# Altium schematic sheet E17-06-PDU_E17-PDU-POWER.SchDoc
size A2
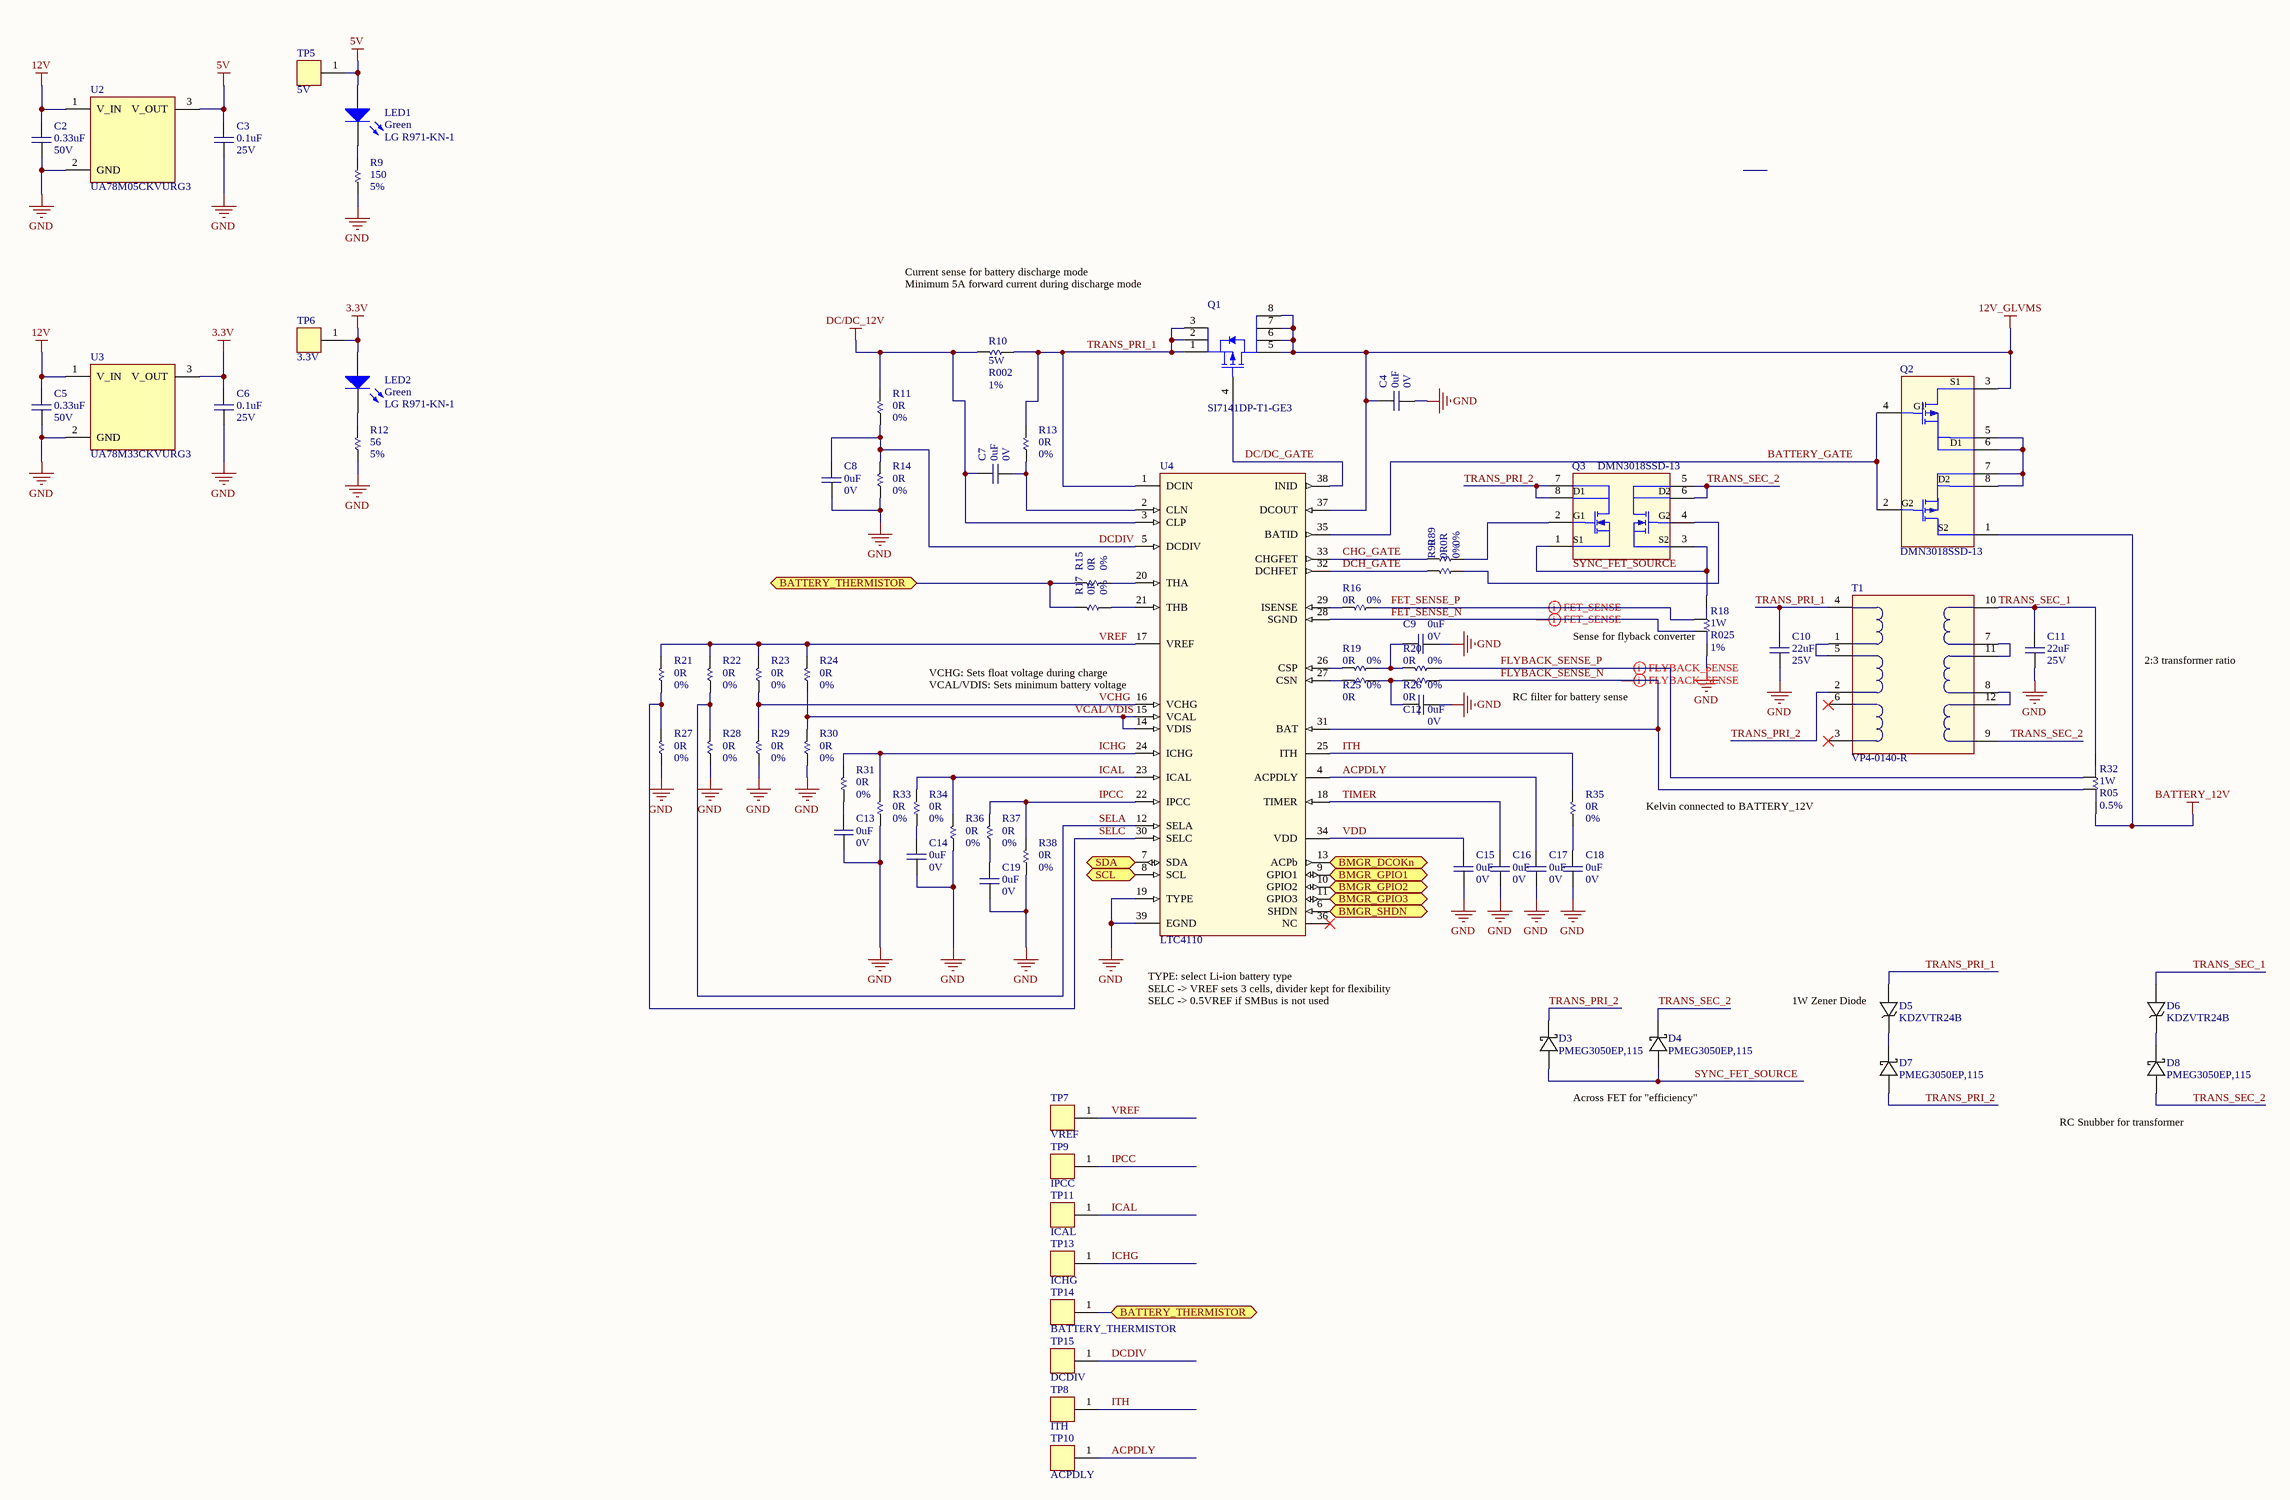
[diagram p0: E17-06-PDU_E17-PDU-POWER.SchDoc]

## Parts
C2  value 0.33uF  Voltage: 50V  [C0805]  (hidden comment: C_0805_Generic)
C3  value 0.1uF  Voltage: 25V  [C0805]  (hidden comment: C_0805_Generic)
C4  value 0uF  Voltage: 0V  [C0603]  (hidden comment: C_0603_Generic_1)
C5  value 0.33uF  Voltage: 50V  [C0805]  (hidden comment: C_0805_Generic)
C6  value 0.1uF  Voltage: 25V  [C0805]  (hidden comment: C_0805_Generic)
C7  value 0uF  Voltage: 0V  [C0603]  (hidden comment: C_0603_Generic_1)
C8  value 0uF  Voltage: 0V  [C0603]  (hidden comment: C_0603_Generic_1)
C9  value 0uF  Voltage: 0V  [C0402]  (hidden comment: C_0403_Generic)
C10  value 22uF  Voltage: 25V  [C0805]  (hidden comment: C_0805_Generic)
C11  value 22uF  Voltage: 25V  [C0805]  (hidden comment: C_0805_Generic)
C12  value 0uF  Voltage: 0V  [C0402]  (hidden comment: C_0403_Generic)
C13  value 0uF  Voltage: 0V  [C0402]  (hidden comment: C_0403_Generic)
C14  value 0uF  Voltage: 0V  [C0402]  (hidden comment: C_0403_Generic)
C15  value 0uF  Voltage: 0V  [C0603]  (hidden comment: C_0603_Generic_1)
C16  value 0uF  Voltage: 0V  [C0402]  (hidden comment: C_0403_Generic)
C17  value 0uF  Voltage: 0V  [C0402]  (hidden comment: C_0403_Generic)
C18  value 0uF  Voltage: 0V  [C0402]  (hidden comment: C_0403_Generic)
C19  value 0uF  Voltage: 0V  [C0402]  (hidden comment: C_0403_Generic)
D3  MFG_PN: PMEG3050EP,115  [SOD-128]  (hidden comment: D_PMEG3050EP,115)
D4  MFG_PN: PMEG3050EP,115  [SOD-128]  (hidden comment: D_PMEG3050EP,115)
D5  MFG_PN: KDZVTR24B  [SOD-123FL]  (hidden comment: D_ZENER)
D6  MFG_PN: KDZVTR24B  [SOD-123FL]  (hidden comment: D_ZENER)
D7  MFG_PN: PMEG3050EP,115  [SOD-128]  (hidden comment: D_PMEG3050EP,115)
D8  MFG_PN: PMEG3050EP,115  [SOD-128]  (hidden comment: D_PMEG3050EP,115)
LED1  Green  MFG_PN: LG R971-KN-1  [LGR971]
LED2  Green  MFG_PN: LG R971-KN-1  [LGR971]
Q1  MFG_PN: SI7141DP-T1-GE3  [PowerPak SO-8]  (hidden comment: Q_SI7141DP-T1-GE3)
Q2  MFG_PN: DMN3018SSD-13  [8-SOIC]  (hidden comment: Q_DMN3018SSD-13_1)
Q3  MFG_PN: DMN3018SSD-13  [8-SOIC]  (hidden comment: Q_DMN3018SSD-13)
R9  value 150  Tolerance: 5%  [R0805]  (hidden comment: R_0805_Generic)
R10  value R002  Power: 5W  Tolerance: 1%  [R2526]  (hidden comment: R_ERJ-MS6SF2M0U)
R11  value 0R  Tolerance: 0%  [R0603]  (hidden comment: R_0603_Generic)
R12  value 56  Tolerance: 5%  [R0805]  (hidden comment: R_0805_Generic)
R13  value 0R  Tolerance: 0%  [R0603]  (hidden comment: R_0603_Generic)
R14  value 0R  Tolerance: 0%  [R0603]  (hidden comment: R_0603_Generic)
R15  value 0R  Tolerance: 0%  [R0603]  (hidden comment: R_0603_Generic)
R16  value 0R  Tolerance: 0%  [R0402]  (hidden comment: R_0402_Generic)
R17  value 0R  Tolerance: 0%  [R0603]  (hidden comment: R_0603_Generic)
R18  value R025  Power: 1W  Tolerance: 1%  [R2512]  (hidden comment: R_LVK24R025FER)
R19  value 0R  Tolerance: 0%  [R0402]  (hidden comment: R_0402_Generic)
R20  value 0R  Tolerance: 0%  [R0402]  (hidden comment: R_0402_Generic)
R21  value 0R  Tolerance: 0%  [R0402]  (hidden comment: R_0402_Generic)
R22  value 0R  Tolerance: 0%  [R0402]  (hidden comment: R_0402_Generic)
R23  value 0R  Tolerance: 0%  [R0402]  (hidden comment: R_0402_Generic)
R24  value 0R  Tolerance: 0%  [R0402]  (hidden comment: R_0402_Generic)
R25  value 0R  Tolerance: 0%  [R0402]  (hidden comment: R_0402_Generic)
R26  value 0R  Tolerance: 0%  [R0402]  (hidden comment: R_0402_Generic)
R27  value 0R  Tolerance: 0%  [R0402]  (hidden comment: R_0402_Generic)
R28  value 0R  Tolerance: 0%  [R0402]  (hidden comment: R_0402_Generic)
R29  value 0R  Tolerance: 0%  [R0402]  (hidden comment: R_0402_Generic)
R30  value 0R  Tolerance: 0%  [R0402]  (hidden comment: R_0402_Generic)
R31  value 0R  Tolerance: 0%  [R0402]  (hidden comment: R_0402_Generic)
R32  value R05  Power: 1W  Tolerance: 0.5%  [R2512]  (hidden comment: R_LVK24R050DER)
R33  value 0R  Tolerance: 0%  [R0402]  (hidden comment: R_0402_Generic)
R34  value 0R  Tolerance: 0%  [R0402]  (hidden comment: R_0402_Generic)
R35  value 0R  Tolerance: 0%  [R0402]  (hidden comment: R_0402_Generic)
R36  value 0R  Tolerance: 0%  [R0402]  (hidden comment: R_0402_Generic)
R37  value 0R  Tolerance: 0%  [R0402]  (hidden comment: R_0402_Generic)
R38  value 0R  Tolerance: 0%  [R0402]  (hidden comment: R_0402_Generic)
R89  value 0R  Tolerance: 0%  [R0603]  (hidden comment: R_0603_Generic)
R90  value 0R  Tolerance: 0%  [R0603]  (hidden comment: R_0603_Generic)
T1  MFG_PN: VP4-0140-R  [T_VP4-0140-R]  (hidden comment: T_VP4-0140-R)
TP5  5V  [TEST POINT]
TP6  3.3V  [TEST POINT]
TP7  VREF  [TEST POINT]
TP8  ITH  [TEST POINT]
TP9  IPCC  [TEST POINT]
TP10  ACPDLY  [TEST POINT]
TP11  ICAL  [TEST POINT]
TP13  ICHG  [TEST POINT]
TP14  BATTERY_THERMISTOR  [TEST POINT]
TP15  DCDIV  [TEST POINT]
U2  MFG_PN: UA78M05CKVURG3  [TO-252-3]  (hidden comment: U_UA78M05CKVURG3)
U3  MFG_PN: UA78M33CKVURG3  [TO-252-3]  (hidden comment: U_UA78M33CKVURG3)
U4  MFG_PN: LTC4110  [U_LTC4110]  (hidden comment: U_LTC4110)

## Ports
BATTERY_THERMISTOR, BMGR_DCOKn, BMGR_GPIO1, BMGR_GPIO2, BMGR_GPIO3, BMGR_SHDN, SCL, SDA

## Nets
3.3V: C6.1(EGND) LED2.1(A) TP6.1 U3.3(V_OUT)
5V: C3.1(EGND) LED1.1(A) TP5.1 U2.3(V_OUT)
12V: C2.1(EGND) C5.1(EGND) U2.1(V_IN) U3.1(V_IN)
12V_GLVMS: C4.1(EGND) Q1.5 Q1.6 Q1.7 Q1.8 Q2.3 U4.37(DCOUT)
BATTERY_12V: Q2.1 R32.1
DC/DC_12V: C7.1(EGND) R10.1 R11.1 U4.3(CLP)
GND: C2.2 C3.2 C4.2 C5.2 C6.2 C8.2 C9.2 C10.2 C11.2 C12.1(EGND) C13.2 C14.2 C15.2 C16.2 C17.2 C18.2 C19.2 R9.2 R12.2 R14.2 R18.1 R27.2 R28.2 R29.2 R30.2 R33.2 R36.2 R38.2 U2.2(GND) U3.2(GND) U4.19(TYPE) U4.39(EGND)
ACPDLY: C17.1(EGND) TP10.1 U4.4(ACPDLY)
BATTERY_GATE: Q2.2 Q2.4 U4.35(BATID)
BATTERY_THERMISTOR: R15.1 R17.1 TP14.1 ; port BATTERY_THERMISTOR
BMGR_DCOKn: U4.13(ACPb) ; port BMGR_DCOKn
BMGR_GPIO1: U4.9(GPIO1) ; port BMGR_GPIO1
BMGR_GPIO2: U4.10(GPIO2) ; port BMGR_GPIO2
BMGR_GPIO3: U4.11(GPIO3) ; port BMGR_GPIO3
BMGR_SHDN: U4.6(SHDN) ; port BMGR_SHDN
CHG_GATE: R89.1 U4.33(CHGFET)
DC/DC_GATE: Q1.4(G) U4.38(INID)
DCDIV: C8.1(EGND) R11.2 R14.1 TP15.1 U4.5(DCDIV)
DCH_GATE: R90.1 U4.32(DCHFET)
FET_SENSE_N: R18.3 U4.28(SGND)
FET_SENSE_P: R16.2 R18.4
FLYBACK_SENSE_N: R26.2 R32.3 U4.31(BAT)
FLYBACK_SENSE_P: R20.2 R32.4
ICAL: R34.1 R36.1 TP11.1 U4.23(ICAL)
ICHG: R31.1 R33.1 TP13.1 U4.24(ICHG)
IPCC: R37.1 R38.1 TP9.1 U4.22(IPCC)
ITH: R35.1 TP8.1 U4.25(ITH)
SCL: U4.8(SCL) ; port SCL
SDA: U4.7(SDA) ; port SDA
SELA: R22.2 R28.1 U4.12(SELA)
SELC: R21.2 R27.1 U4.30(SELC)
SYNC_FET_SOURCE: D3.1 D4.1 Q3.1 Q3.3 R18.2
TIMER: C16.1(EGND) U4.18(TIMER)
TRANS_PRI_1: C10.1(EGND) D5.1 Q1.1 Q1.2 Q1.3 R10.2 R13.1 T1.4 U4.1(DCIN)
TRANS_PRI_2: D3.2 D7.1 Q3.7 Q3.8 T1.2
TRANS_SEC_1: C11.1(EGND) D6.1 R32.2 T1.10
TRANS_SEC_2: D4.2 D8.1 Q3.5 Q3.6 T1.9
VCAL/VDIS: R24.2 R30.1 U4.14(VDIS) U4.15(VCAL)
VCHG: R23.2 R29.1 U4.16(VCHG)
VDD: C15.1(EGND) U4.34(VDD)
VREF: R21.1 R22.1 R23.1 R24.1 TP7.1 U4.17(VREF)
NetC7_2: C7.2 R13.2 U4.2(CLN)
NetC9_1: C9.1(EGND) R19.2 R20.1
NetC12_2: C12.2 R25.2 R26.1
NetC13_1: C13.1(EGND) R31.2
NetC14_1: C14.1(EGND) R34.2
NetC18_1: C18.1(EGND) R35.2
NetC19_1: C19.1(EGND) R37.2
NetD5_2: D5.2 D7.2
NetD6_2: D6.2 D8.2
NetLED1_2: LED1.2(K) R9.1
NetLED2_2: LED2.2(K) R12.1
NetQ2_5: Q2.5 Q2.6 Q2.7 Q2.8
NetQ3_2: Q3.2 R89.2
NetQ3_4: Q3.4 R90.2
NetR15_2: R15.2 U4.20(THA)
NetR16_1: R16.1 U4.29(ISENSE)
NetR17_2: R17.2 U4.21(THB)
NetR19_1: R19.1 U4.26(CSP)
NetR25_1: R25.1 U4.27(CSN)
NetT1_1: T1.1 T1.5
NetT1_7: T1.7 T1.11
NetT1_8: T1.8 T1.12

Not connected (* = marked no-connect by the designer): T1 3* 6*; U4 36(NC)*

## Layout directives
differential pair: FET_SENSE_N, FET_SENSE_P, FLYBACK_SENSE_N, FLYBACK_SENSE_P

## Notes on the sheet
- Current sense for battery discharge mode
- Minimum 5A forward current during discharge mode
- (near R18) Sense for flyback converter
- (near U4) VCAL/VDIS: Sets minimum battery voltage
- (near U4) VCHG: Sets float voltage during charge
- RC filter for battery sense
- 2:3 transformer ratio
- Kelvin connected to BATTERY_12V
- TYPE: select Li-ion battery type
- SELC -> VREF sets 3 cells, divider kept for flexibility
- SELC -> 0.5VREF if SMBus is not used
- (near D5) 1W Zener Diode
- Across FET for "efficiency"
- (near D8) RC Snubber for transformer
- (in symbol Q_DMN3018SSD-13) D1; D2; G1; G2; S1; S2
- (in symbol Q_DMN3018SSD-13_1) S1; G1; D1; D2; G2; S2

## Library data of the parts
C2 C3 C5 C6 = C_0805_Generic: Generic 0805 Capacitor; Tolerance: 10%; Supplier: Digikey
  C2 C5: Supplier_PN: 1276-1123-1-ND
  C3 C6: Supplier_PN: 1276-1099-1-ND
C4 C7 C8 C15 = C_0603_Generic_1: Generic 0603 Capacitor; Tolerance: 0%; Supplier: Digikey; Supplier_PN: 000-000-00-ND
C9 C12-C14 C16-C19 = C_0403_Generic: Generic 0402 Capacitor; Tolerance: 0%; Supplier: Digikey; Supplier_PN: 000-000-00-ND
C10 C11 = C_0805_Generic: Generic 0805 Capacitor; Tolerance: 20%; Supplier: Digikey; Supplier_PN: 490-12389-1-ND
D3 D4 D7 D8 = D_PMEG3050EP,115: DIODE SCHOTTKY 360mV 30V 5A; MFG: Nexperia; Supplier: Digikey; Supplier_PN: 1727-5317-1-ND
D5 D6 = D_ZENER: DIODE ZENER 24V 1W PMDU; MFG: Rohm Semiconductor; Supplier: Digikey; Supplier_PN: KDZVTR24BCT-ND
LED1 LED2 = LED_LGR971: Green LED; MFG: OSRAM Opto Semiconductors Inc.; Supplier: Digikey; Supplier_PN: 475-1410-1-ND
Q1 = Q_SI7141DP-T1-GE3: P-CH 20V 60A PowerPak SO-8; MFG: Vishay; Supplier: Digikey; Supplier_PN: SI7141DP-T1-GE3CT-ND
Q2 = Q_DMN3018SSD-13_1: 2x P-ch FET 40V 6.7A; MFG: ON Semiconductor; Supplier: Digikey; Supplier_PN: NTMD5838NLR2GOSCT-ND
Q3 = Q_DMN3018SSD-13: 2x N-ch FET 40V 6.7A; MFG: ON Semiconductor; Supplier: Digikey; Supplier_PN: NTMD5838NLR2GOSCT-ND
R9 R12 = R_0805_Generic: Generic 0805 Resistor; Power: 1/8W; Supplier: Digikey
  R9: Supplier_PN: P150ACT-ND
  R12: Supplier_PN: P56ACT-ND
R10 = R_ERJ-MS6SF2M0U: RES CURRENT SENSE R002 1% 5W; MFG: Panasonic; Supplier: Digikey; Supplier_PN: P17101CT-ND; MFG_PN: ERJ-MS6SF2M0U
R11 R13-R15 R17 R89 R90 = R_0603_Generic: Generic 0603 Resistor; Power: 0W; Supplier: Digikey; Supplier_PN: 000-00-00-ND
R16 R19-R31 R33-R38 = R_0402_Generic: Generic 0402 Resistor; Power: 0W; Supplier: Digikey; Supplier_PN: 000-00-00-ND
R18 = R_LVK24R025FER: RES CURRENT SENSE R025 1% 1W; MFG: Ohmite; Supplier: Digikey; Supplier_PN: LVK24R025FERCT-ND; MFG_PN: LVK24R025FER
R32 = R_LVK24R050DER: RES CURRENT SENSE R05 0.5% 1W; MFG: Ohmite; Supplier: Digikey; Supplier_PN: LVK24R050DERCT-ND; MFG_PN: LVK24R050DER
T1 = T_VP4-0140-R: Transformer 6 coil 11.3uH; MFG: Eaton; Supplier: Digikey; Supplier_PN: 513-1558-ND
TP5-TP11 TP13-TP15 = Test Point
U2 = U_UA78M05CKVURG3: 5V 500mA Linear Regulator; MFG: TI; Supplier: Digikey; Supplier_PN: 296-19755-1-ND
U3 = U_UA78M33CKVURG3: 3.3V 500mA Linear Regulator; MFG: TI; Supplier: Digikey; Supplier Part Number: 296-21208-1-ND
U4 = U_LTC4110: IC Battery Backup Manager; MFG: Linear Technology; Supplier_PN: LTC4110EUHF#PBF-ND; Supplier: Digikey